# EAGLE schematic GODHONG Re Design (EAGLE 9.6.2)

## Sheet 1 of 2
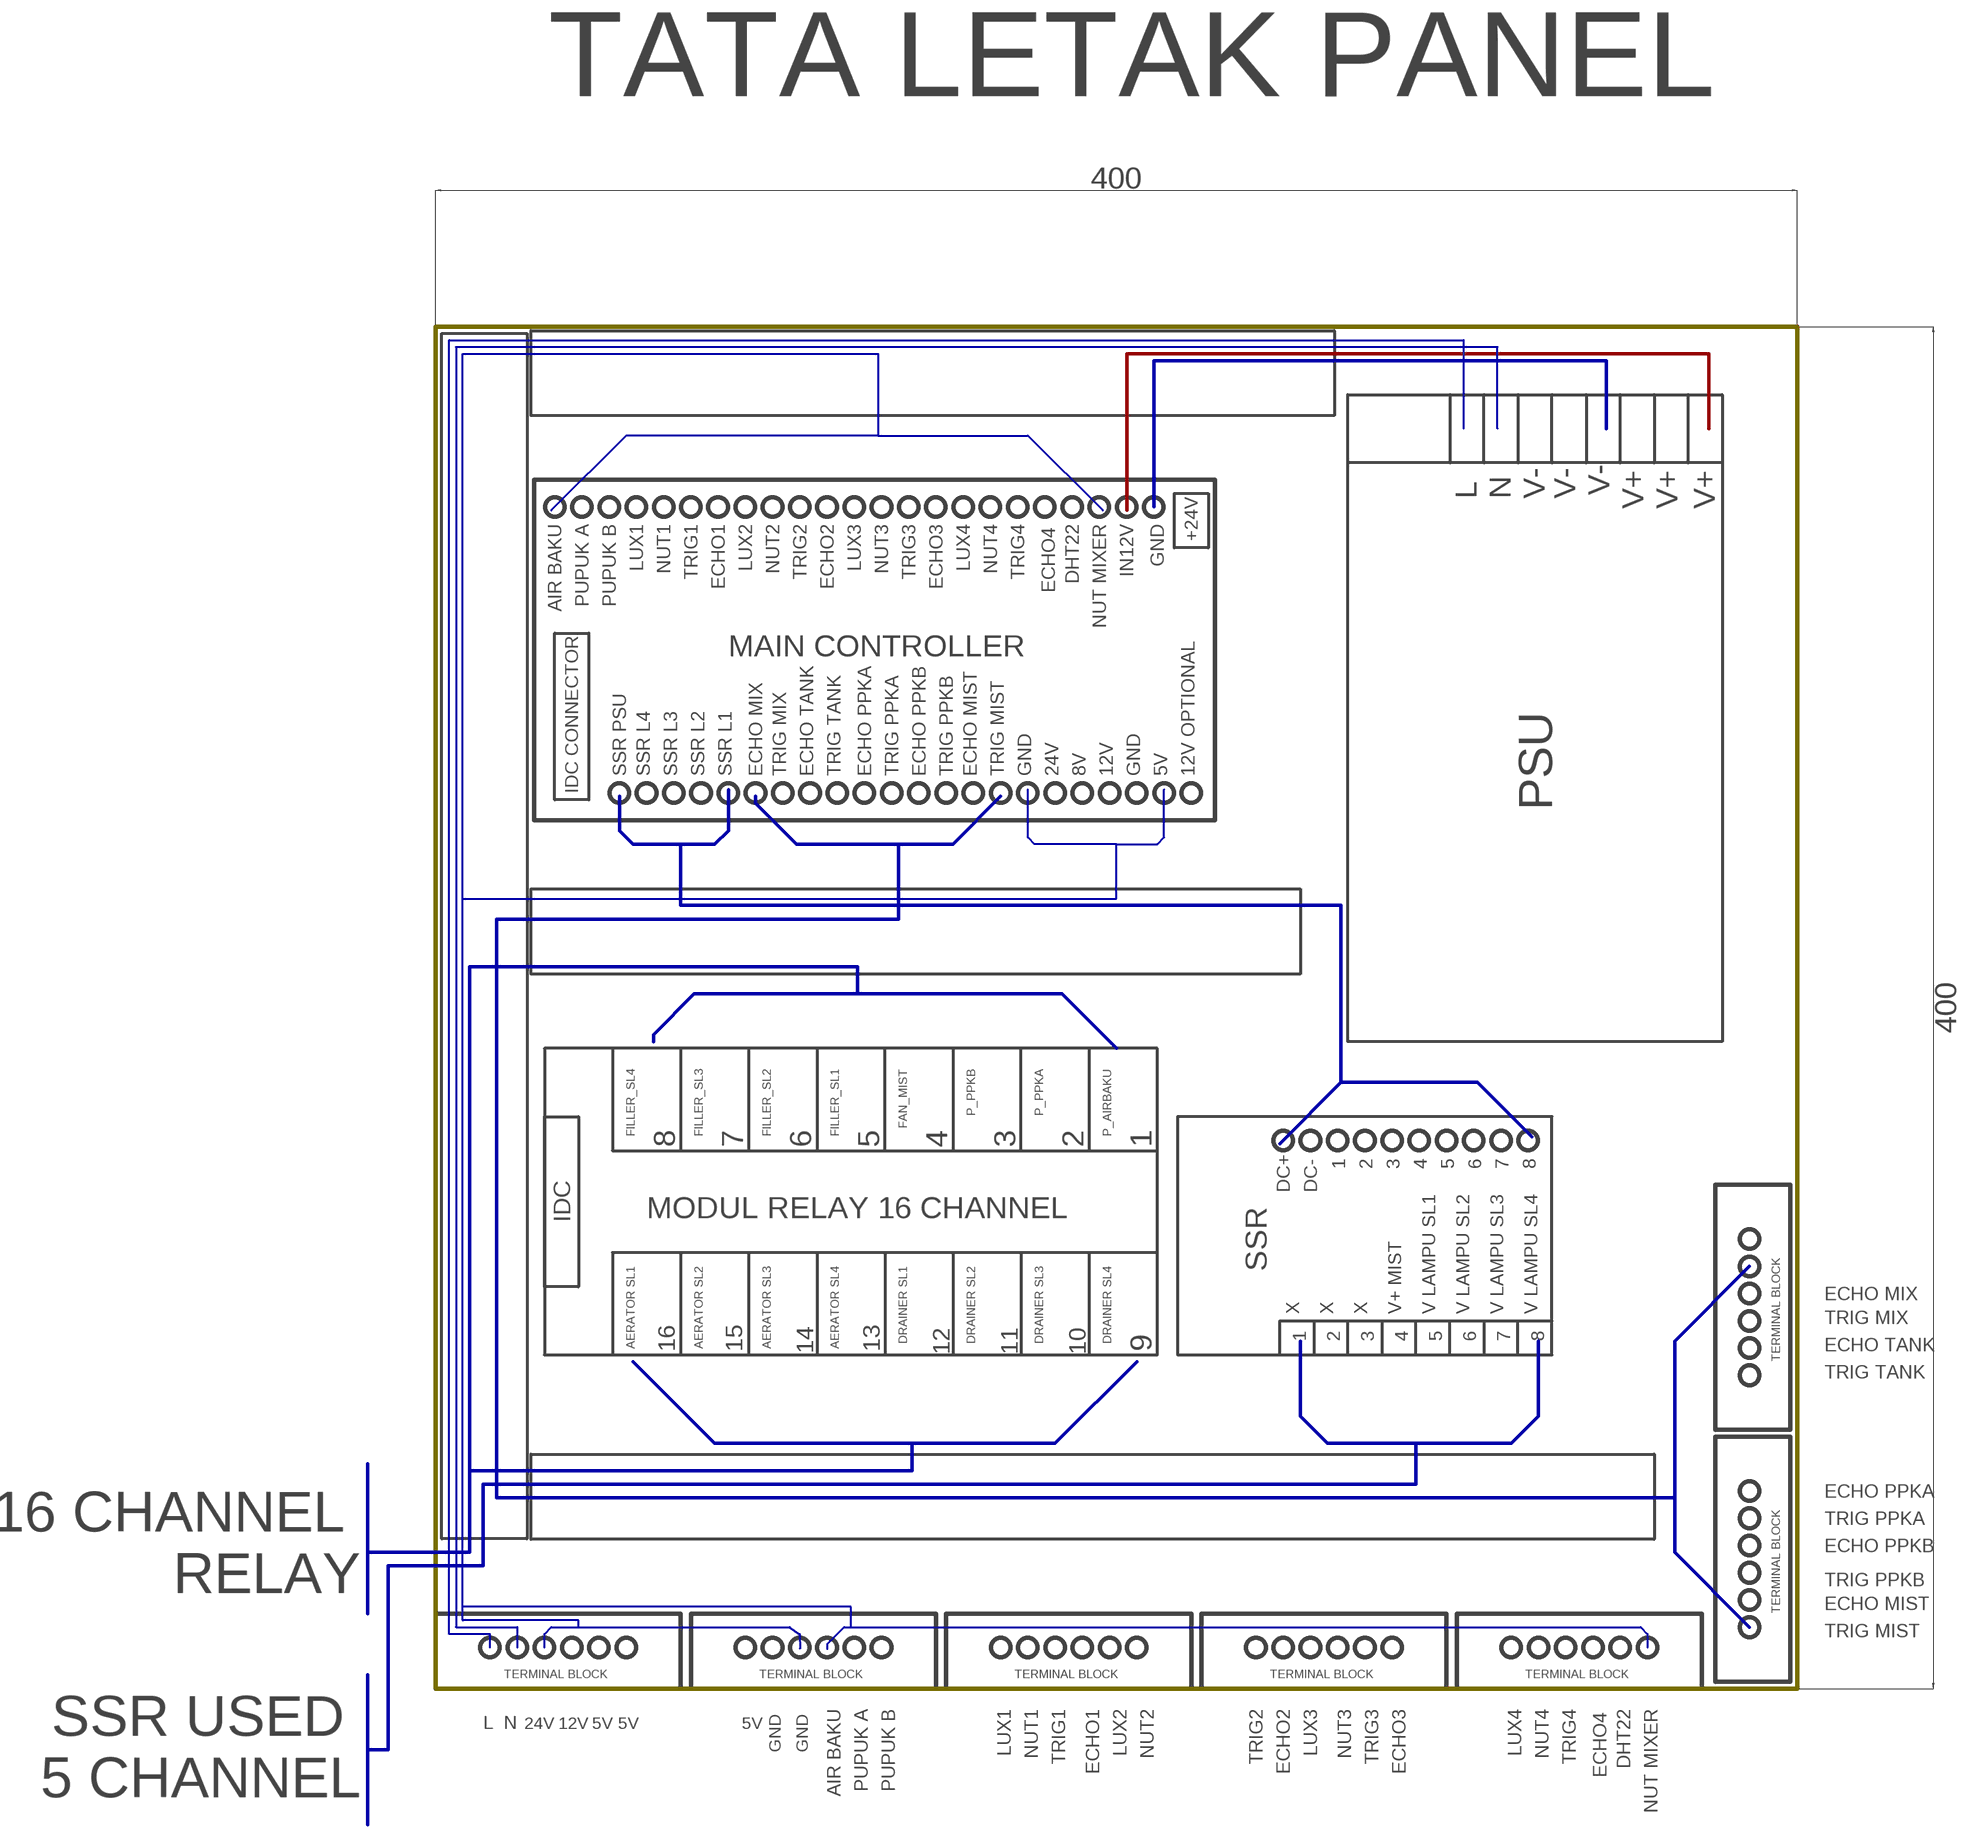
[diagram p0: schematic, sheet 1]

### Buses
B$1
B$2
B$3
B$4
B$5
B$6
B$7
B$8

### Notes on the sheet
- TATA LETAK PANEL
- L | N | V- | V- | V-
- V+ | V+ | V+
- AIR BAKU | PUPUK A | PUPUK B | LUX1 | NUT1 | TRIG1 | ECHO1 | LUX2 | NUT2 | TRIG2 | ECHO2 | LUX3 | NUT3 | TRIG3 | ECHO3 | LUX4 | NUT4 | TRIG4 | ECHO4 | DHT22 | NUT MIXER | IN12V | GND
- +24V
- MAIN CONTROLLER
- SSR PSU | SSR L4 | SSR L3 | SSR L2 | SSR L1 | ECHO MIX | TRIG MIX | ECHO TANK | TRIG TANK | ECHO PPKA | TRIG PPKA | ECHO PPKB | TRIG PPKB | ECHO MIST | TRIG MIST | GND | 24V | 8V | 12V | GND | 5V | 12V OPTIONAL
- IDC CONNECTOR
- PSU
- FILLER_SL4 | FILLER_SL3 | FILLER_SL2 | FILLER_SL1 | FAN_MIST | P_PPKB | P_PPKA | P_AIRBAKU
- 8 | 7 | 6 | 5 | 4 | 3 | 2 | 1
- 1 | 2 | 3 | 4 | 5 | 6 | 7 | 8
- IDC
- DC+ | DC-
- MODUL RELAY 16 CHANNEL
- AERATOR SL1 | AERATOR SL2 | AERATOR SL3 | AERATOR SL4 | DRAINER SL1 | DRAINER SL2 | DRAINER SL3 | DRAINER SL4
- SSR
- ECHO MIX
- X | X | X | V+ MIST | V LAMPU SL1 | V LAMPU SL2 | V LAMPU SL3 | V LAMPU SL4
- 16 | 15 | 14 | 13 | 12 | 11 | 10 | TRIG MIX
- 9
- 1 | 2 | 3 | 4 | 5 | 6 | 7 | 8
- ECHO TANK
- TERMINAL BLOCK
- TRIG TANK
- 16 CHANNEL 
  RELAY
- ECHO PPKA
- TRIG PPKA
- ECHO PPKB
- TRIG PPKB
- TERMINAL BLOCK | ECHO MIST
- TRIG MIST
- TERMINAL BLOCK | TERMINAL BLOCK | TERMINAL BLOCK | TERMINAL BLOCK | TERMINAL BLOCK
- SSR USED 
  5 CHANNEL
- AIR BAKU | PUPUK A | PUPUK B | LUX1 | NUT1 | TRIG1 | ECHO1 | LUX2 | NUT2 | TRIG2 | ECHO2 | LUX3 | NUT3 | TRIG3 | ECHO3 | LUX4 | NUT4 | TRIG4 | ECHO4 | DHT22 | NUT MIXER
- GND | GND
- L | N | 24V | 12V | 5V | 5V | 5V

## Sheet 2 of 2
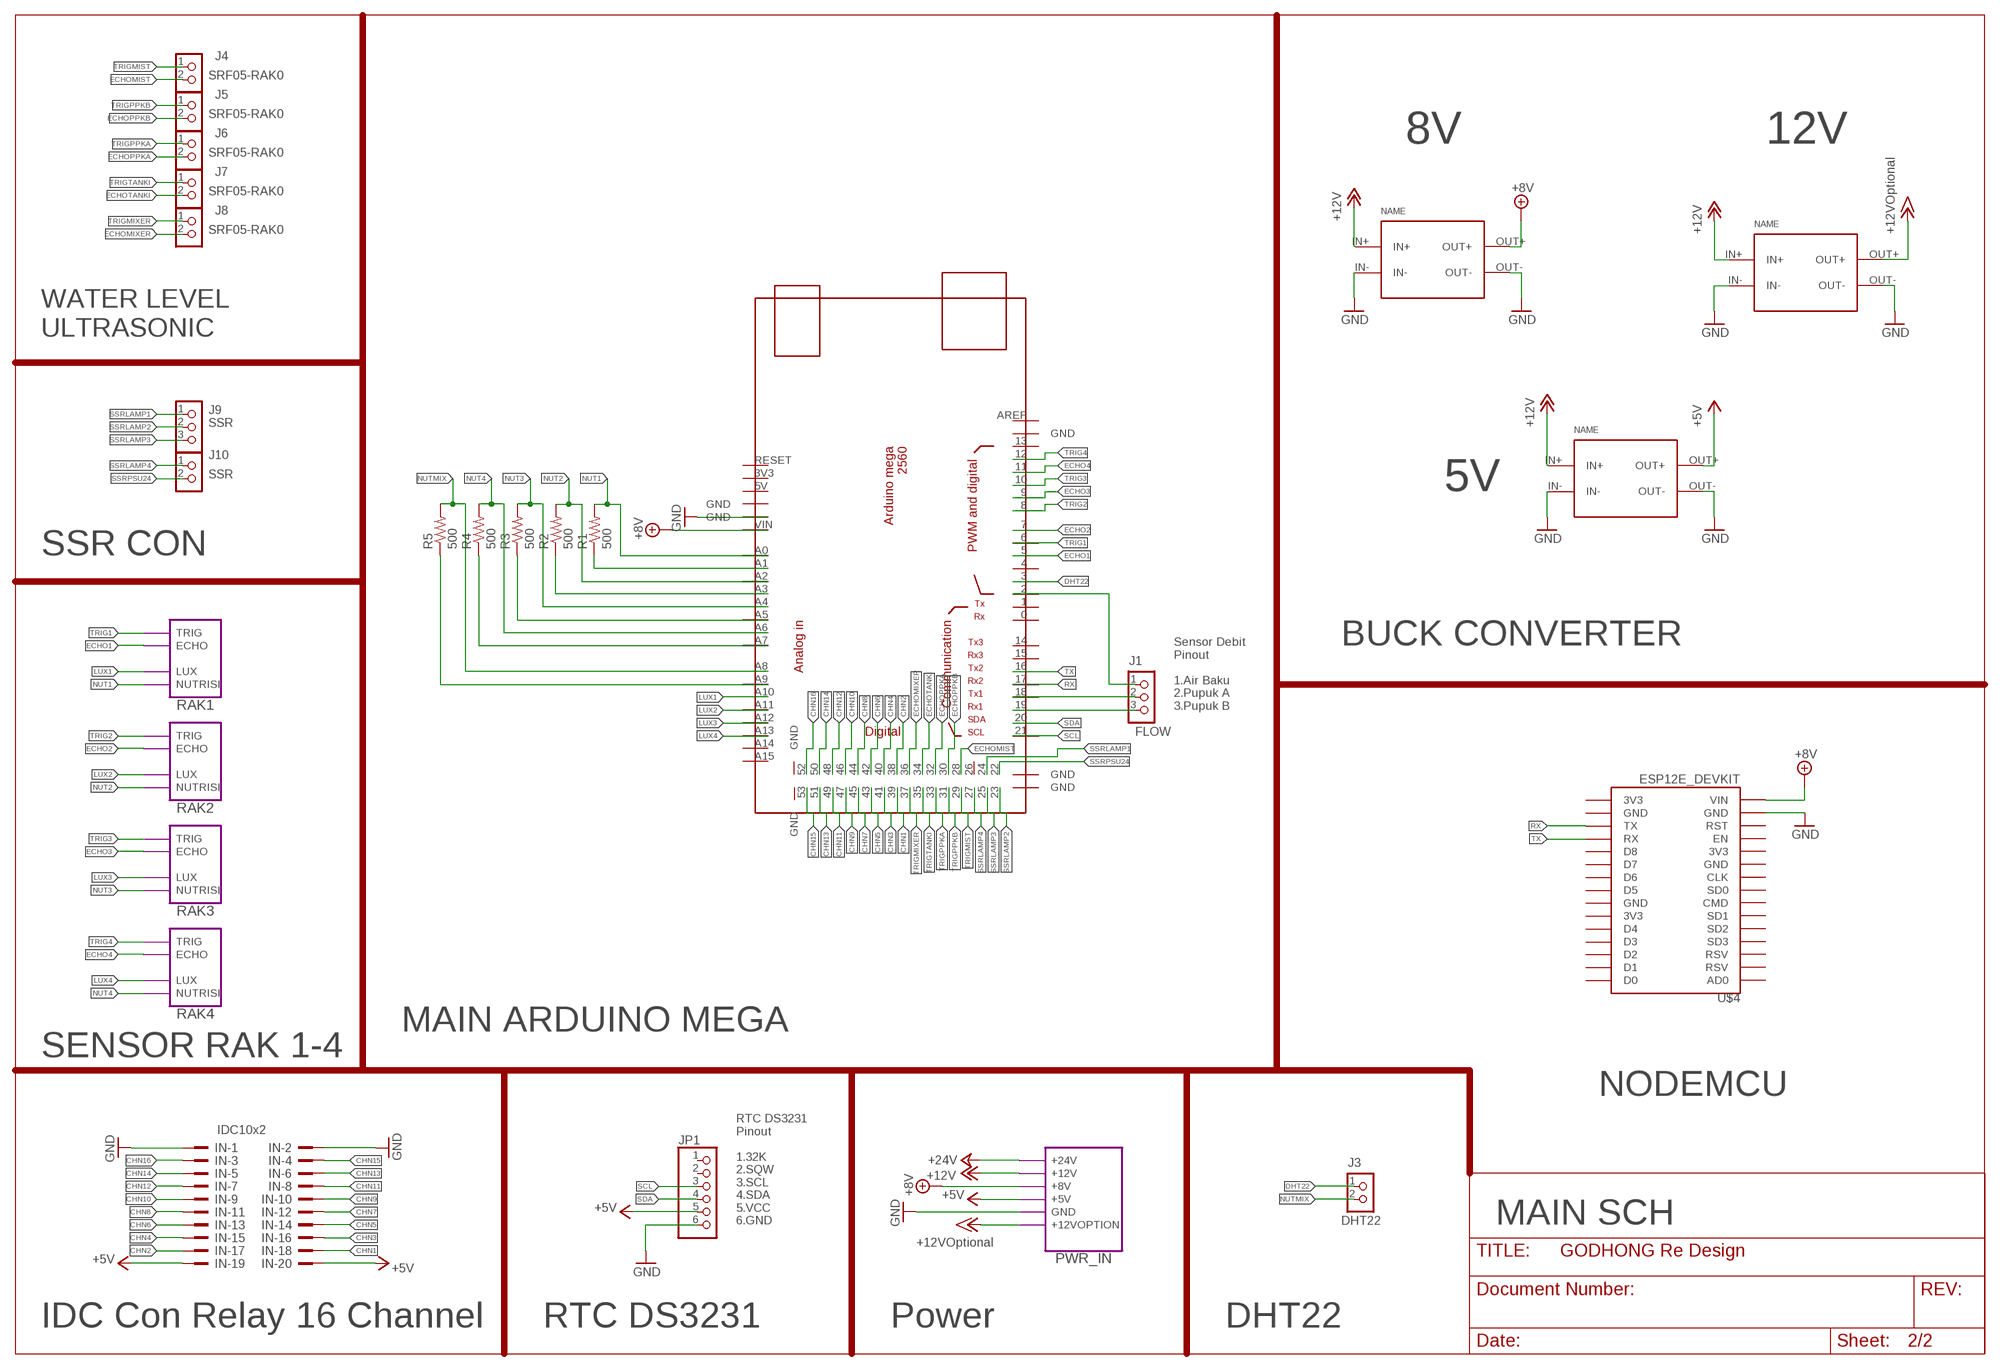
[diagram p1: schematic, sheet 2]
FRAME1 (DINA3_L): TITLE: MAIN SCH

### Parts
5V  5V  CP8-ADJ  [CP8-ADJ]
8V  8V  CP8-ADJ  [CP8-ADJ]
12OPTION  12Option  CP8-ADJ  [CP8-ADJ]
IN  IDC10x2  2520-  [PAK100/2500-20]
J1  Debit  CON_TERMINAL_BLOCK_03-5MM  [TERMINAL_BLOCK_3P_5]
J3  SRF05  CON_TERMINAL_BLOCK_02-5MM  [TERMINAL_BLOCK_2P_5]
J4  SRF05  CON_TERMINAL_BLOCK_02-5MM  [TERMINAL_BLOCK_2P_5]
J5  SRF05  CON_TERMINAL_BLOCK_02-5MM  [TERMINAL_BLOCK_2P_5]
J6  SRF05  CON_TERMINAL_BLOCK_02-5MM  [TERMINAL_BLOCK_2P_5]
J7  SRF05  CON_TERMINAL_BLOCK_02-5MM  [TERMINAL_BLOCK_2P_5]
J8  SRF05  CON_TERMINAL_BLOCK_02-5MM  [TERMINAL_BLOCK_2P_5]
J9  Debit  CON_TERMINAL_BLOCK_03-5MM  [TERMINAL_BLOCK_3P_5]
J10  SRF05  CON_TERMINAL_BLOCK_02-5MM  [TERMINAL_BLOCK_2P_5]
JP1  PINHD-1X6  [1X06]
R1  500  R-US_0207/10  [0207/10]
R2  500  R-US_0207/10  [0207/10]
R3  500  R-US_0207/10  [0207/10]
R4  500  R-US_0207/10  [0207/10]
R5  500  R-US_0207/10  [0207/10]
U$1  MEGA_DEVICE  [MEGAOUTLINE]
U$4  ESP12E_DEVKIT  [ESP12E_DEVKIT]

### Module instances
RAK1 = RAK
RAK2 = RAK
RAK3 = RAK
RAK4 = RAK
PWR_IN = PWR

### Nets
+5V: 5V.OUT+ IN.19 IN.20 JP1.5 ; port PWR_IN.+5V
+8V: 8V.OUT+ U$1.VIN U$4.VIN ; port PWR_IN.+8V
+12V: 5V.IN+ 8V.IN+ 12OPTION.IN+ ; port PWR_IN.+12V
+15V: 12OPTION.OUT+ ; port PWR_IN.+12VOPTION ; supply symbol labelled +12VOptional
+24V: port PWR_IN.+24V
CHN1: IN.18 U$1.39
CHN2: IN.17 U$1.38
CHN3: IN.16 U$1.41
CHN4: IN.15 U$1.40
CHN5: IN.14 U$1.43
CHN6: IN.13 U$1.42
CHN7: IN.12 U$1.45
CHN8: IN.11 U$1.44
CHN9: IN.10 U$1.47
CHN10: IN.9 U$1.46
CHN11: IN.8 U$1.49
CHN12: IN.7 U$1.48
CHN13: IN.6 U$1.51
CHN14: IN.5 U$1.50
CHN15: IN.4 U$1.53
CHN16: IN.3 U$1.52
DHT22: J3.1 U$1.3
ECHO1: U$1.5 ; port RAK1.ECHO
ECHO2: U$1.7 ; port RAK2.ECHO
ECHO3: U$1.9 ; port RAK3.ECHO
ECHO4: U$1.11 ; port RAK4.ECHO
ECHOMIST: J4.2 U$1.28
ECHOMIXER: J8.2 U$1.36
ECHOPPKA: J6.2 U$1.32
ECHOPPKB: J5.2 U$1.30
ECHOTANKI: J7.2 U$1.34
FLOWAIRBAKU: J1.1 U$1.2
FLOWPPKA: J1.2 U$1.18
FLOWPPKB: J1.3 U$1.19
GND: 5V.IN- 5V.OUT- 8V.IN- 8V.OUT- 12OPTION.IN- 12OPTION.OUT- IN.1 IN.2 JP1.6 U$1.GND@3(GND) U$4.GND@1(GND) ; port PWR_IN.GND
LUX1: U$1.A10 ; port RAK1.LUX
LUX2: U$1.A11 ; port RAK2.LUX
LUX3: U$1.A12 ; port RAK3.LUX
LUX4: U$1.A13 ; port RAK4.LUX
N$2: R1.1 U$1.A1
N$4: R2.1 U$1.A3
N$6: R3.1 U$1.A5
N$8: R4.1 U$1.A7
N$10: R5.1 U$1.A9
NUT1: R1.2 U$1.A0 ; port RAK1.NUTRISI
NUT2: R2.2 U$1.A2 ; port RAK2.NUTRISI
NUT3: R3.2 U$1.A4 ; port RAK3.NUTRISI
NUT4: R4.2 U$1.A6 ; port RAK4.NUTRISI
NUTMIX: J3.2 R5.2 U$1.A8
RX: U$1.17 U$4.TX
SCL: JP1.3 U$1.21
SDA: JP1.4 U$1.20
SSRLAMP1: J9.1 U$1.24
SSRLAMP2: J9.2 U$1.23
SSRLAMP3: J9.3 U$1.25
SSRLAMP4: J10.1 U$1.27
SSRPSU24: J10.2 U$1.22
TRIG1: U$1.6 ; port RAK1.TRIG
TRIG2: U$1.8 ; port RAK2.TRIG
TRIG3: U$1.10 ; port RAK3.TRIG
TRIG4: U$1.12 ; port RAK4.TRIG
TRIGMIST: J4.1 U$1.29
TRIGMIXER: J8.1 U$1.37
TRIGPPKA: J6.1 U$1.33
TRIGPPKB: J5.1 U$1.31
TRIGTANKI: J7.1 U$1.35
TX: U$1.16 U$4.RX
Unconnected: JP1.1 JP1.2 U$1.0 U$1.1 U$1.3V3 U$1.4 U$1.5V U$1.13 U$1.14 U$1.15 U$1.26 U$1.A14 U$1.A15 U$1.AREF U$1.GND@1(GND) U$1.GND@2(GND) U$1.GND@4(GND) U$1.GND@5(GND) U$1.GND@6(GND) U$1.GND@7(GND) U$1.RESET U$4.3V3@0(3V3) U$4.3V3@1(3V3) U$4.3V3@2(3V3) U$4.AD0 U$4.CLK U$4.CMD U$4.D0 U$4.D1 U$4.D2 U$4.D3 U$4.D4 U$4.D5 U$4.D6 U$4.D7 U$4.D8 U$4.EN U$4.GND@0(GND) U$4.GND@2(GND) U$4.GND@3(GND) U$4.RST U$4.RSV@0(RSV) U$4.RSV@1(RSV) U$4.SD0 U$4.SD1 U$4.SD2 U$4.SD3

### Notes on the sheet
- 8V | 12V
- WATER LEVEL
  ULTRASONIC
- 5V
- SSR CON
- BUCK CONVERTER
- Sensor Debit
  Pinout
  
  1.Air Baku
  2.Pupuk A
  3.Pupuk B
- MAIN ARDUINO MEGA
- SENSOR RAK 1-4
- NODEMCU
- RTC DS3231
  Pinout
  
  1.32K
  2.SQW
  3.SCL
  4.SDA
  5.VCC
  6.GND
- IDC Con Relay 16 Channel | RTC DS3231 | Power | DHT22

## Library data of the parts
5V 8V 12OPTION = userlib:CP8-ADJ: Voltage regulator IN: 7-35V OUT: ADJ
IN = con-3m:2520-: 3M (TM) Pak 100 4-Wall Header Source: 3M; OC_FARNELL: unknown; OC_NEWARK: unknown
J1 = dp_devices.v6:CON_TERMINAL_BLOCK_03: 3 poles, wire to board connector; COMP: FLOW
J3 = dp_devices.v6:CON_TERMINAL_BLOCK_02: 2 poles wire to board terminal block; COMP: DHT22
J4-J8 = dp_devices.v6:CON_TERMINAL_BLOCK_02: 2 poles wire to board terminal block; COMP: SRF05-RAK0
J9 = dp_devices.v6:CON_TERMINAL_BLOCK_03: 3 poles, wire to board connector; COMP: SSR
J10 = dp_devices.v6:CON_TERMINAL_BLOCK_02: 2 poles wire to board terminal block; COMP: SSR
JP1 = pinhead:PINHD-1X6: PIN HEADER
R1-R5 = rcl:R-US_: RESISTOR, American symbol; SPICEPREFIX: R
U$1 = ArduinoMegaOutline:MEGA_DEVICE: mega card as device
U$4 = ESP12E_DEVKIT:ESP12E_DEVKIT: ESP12E DEVKIT BOARD

## Module RAK
Ports: TRIG(io) ECHO(io) LUX(io) NUTRISI(io)
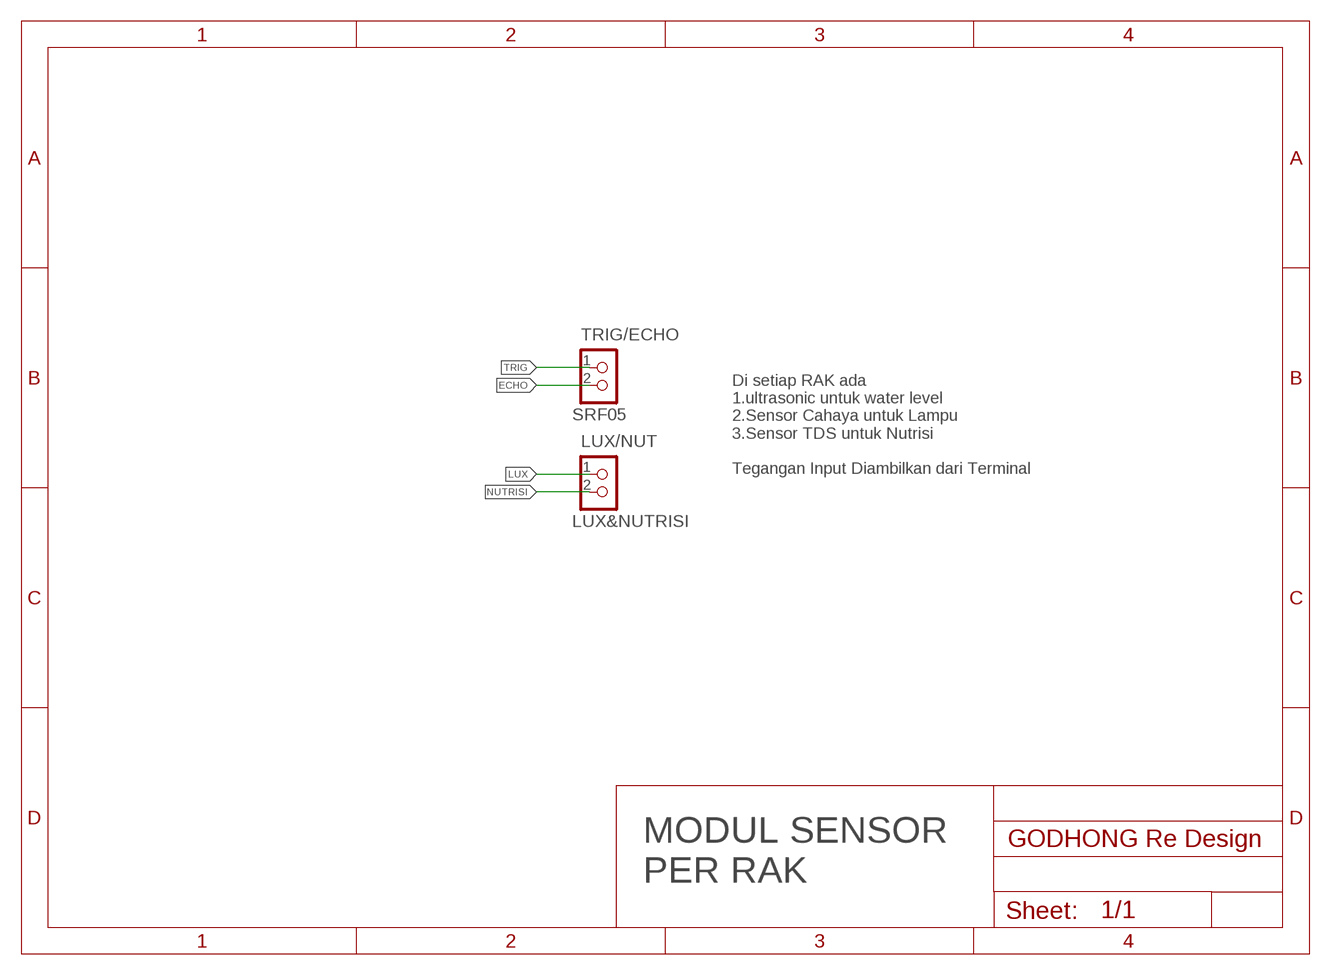
[diagram p2: schematic, module RAK, sheet 1]

### Parts
LUX/NUT  SRF05  CON_TERMINAL_BLOCK_02-5MM  [TERMINAL_BLOCK_2P_5]
TRIG/ECHO  SRF05  CON_TERMINAL_BLOCK_02-5MM  [TERMINAL_BLOCK_2P_5]

### Nets
ECHO: TRIG/ECHO.2
LUX: LUX/NUT.1
NUTRISI: LUX/NUT.2
TRIG: TRIG/ECHO.1

### Notes on the sheet
- Di setiap RAK ada 
  1.ultrasonic untuk water level
  2.Sensor Cahaya untuk Lampu
  3.Sensor TDS untuk Nutrisi
  
  Tegangan Input Diambilkan dari Terminal
- MODUL SENSOR 
  PER RAK

### Library data of the parts
LUX/NUT = dp_devices.v6:CON_TERMINAL_BLOCK_02: 2 poles wire to board terminal block; COMP: LUX&NUTRISI
TRIG/ECHO = dp_devices.v6:CON_TERMINAL_BLOCK_02: 2 poles wire to board terminal block; COMP: SRF05

## Module PWR
Ports: +24V(io) +12V(io) +8V(io) +5V(io) GND(io) +12VOPTION(io)
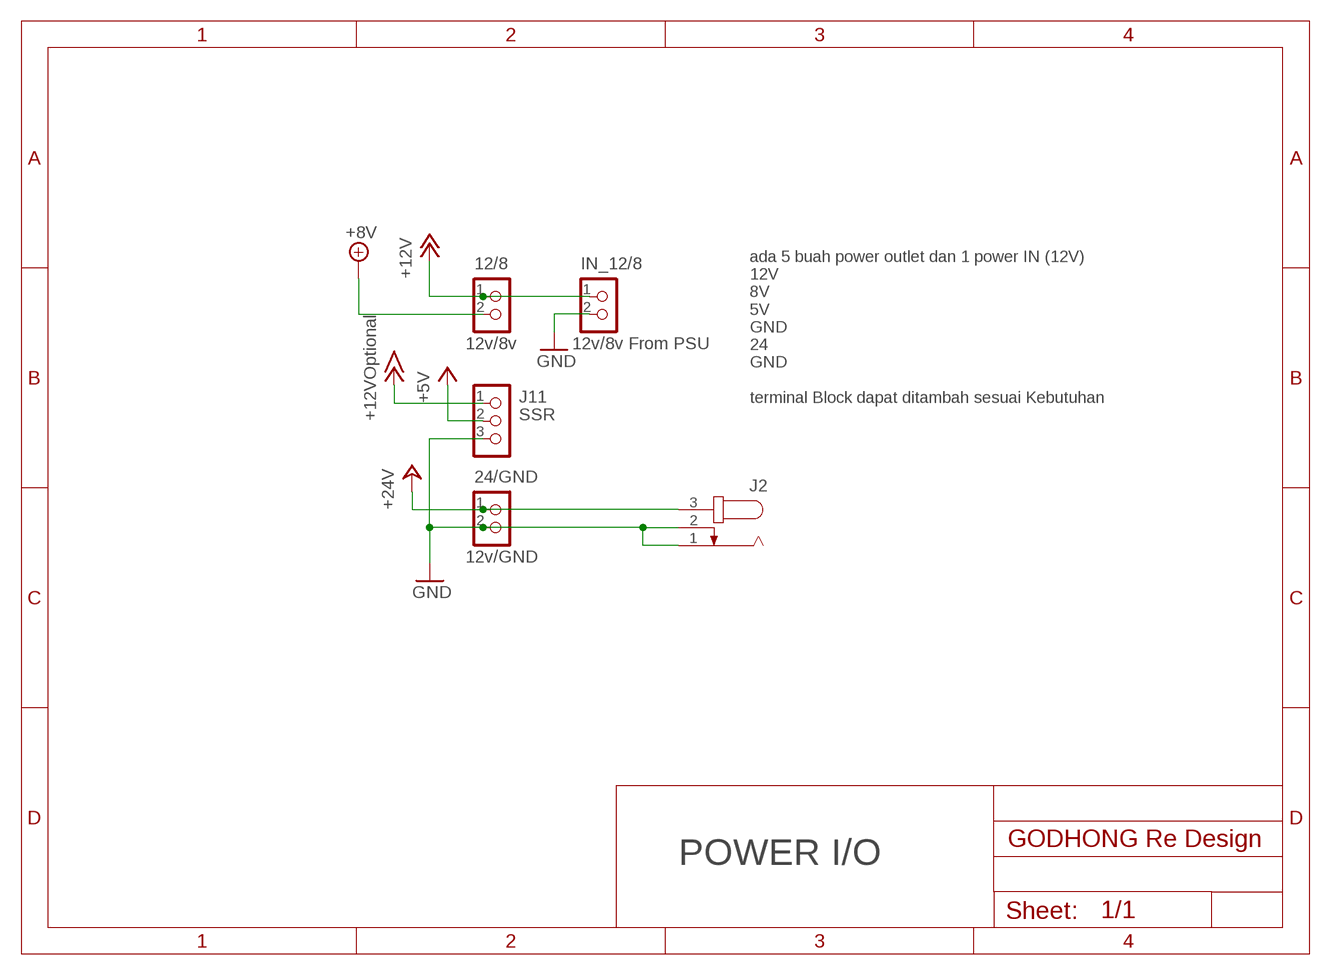
[diagram p3: schematic, module PWR, sheet 1]

### Parts
12/8  SRF05  CON_TERMINAL_BLOCK_02-5MM  [TERMINAL_BLOCK_2P_5]
24/GND  SRF05  CON_TERMINAL_BLOCK_02-5MM  [TERMINAL_BLOCK_2P_5]
IN_12/8  SRF05  CON_TERMINAL_BLOCK_02-5MM  [TERMINAL_BLOCK_2P_5]
J2  JACK-PLUG1  [SPC4078]
J11  Debit  CON_TERMINAL_BLOCK_03-5MM  [TERMINAL_BLOCK_3P_5]

### Nets
+5V: J11.2
+8V: 12/8.2
+12V: 12/8.1 IN_12/8.1
+12VOPTION: J11.1 ; supply symbol labelled +12VOptional
+24V: 24/GND.1 J2.3
GND: 24/GND.2 IN_12/8.2 J2.1 J2.2 J11.3

### Notes on the sheet
- ada 5 buah power outlet dan 1 power IN (12V)
  12V
  8V 
  5V
  GND
  24
  GND
  
  terminal Block dapat ditambah sesuai Kebutuhan
- POWER I/O

### Library data of the parts
12/8 = dp_devices.v6:CON_TERMINAL_BLOCK_02: 2 poles wire to board terminal block; COMP: 12v/8v
24/GND = dp_devices.v6:CON_TERMINAL_BLOCK_02: 2 poles wire to board terminal block; COMP: 12v/GND
IN_12/8 = dp_devices.v6:CON_TERMINAL_BLOCK_02: 2 poles wire to board terminal block; COMP: 12v/8v From PSU
J2 = con-jack:JACK-PLUG: DC POWER JACK Power Jack, DC, Right Angle, Through Hole, Rated 5A at 16VDC, PC Terminals Distributor: Farnell (www.Farnell.de) Drawing: 84N1161.pdf / 84N1162.pdf Manufacturer: SPC Technology (www.spctechnology.com) Type: SPC4077 / SPC 4078; OC_FARNELL: unknown; OC_NEWARK: unknown
J11 = dp_devices.v6:CON_TERMINAL_BLOCK_03: 3 poles, wire to board connector; COMP: SSR